# EAGLE schematic carte_mere_mbed (EAGLE 6.1)
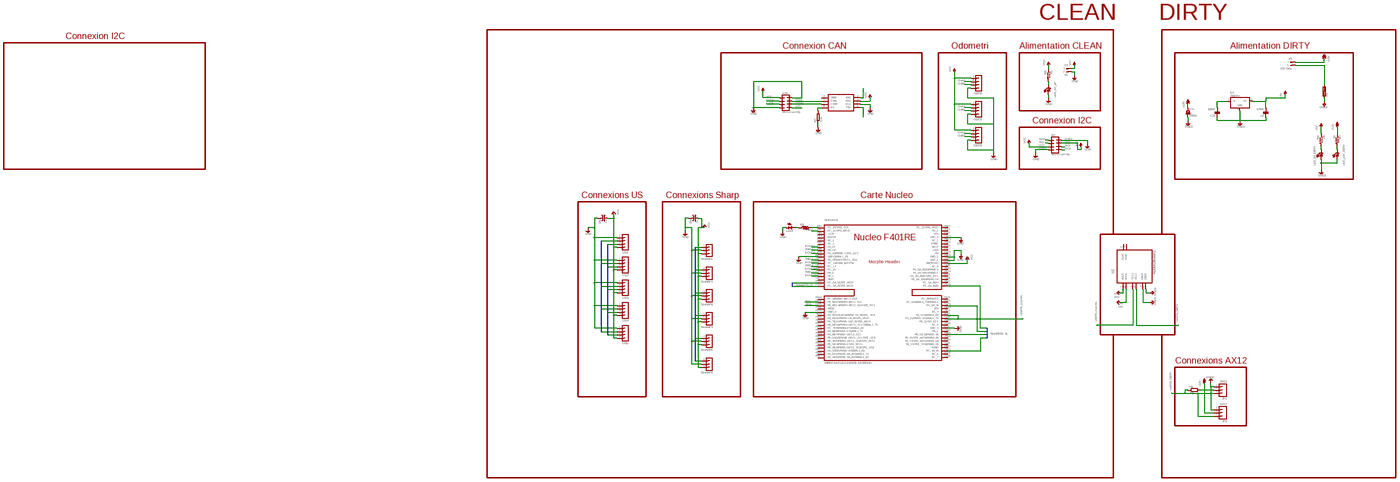
[diagram p0: schematic, sheet 1, overview]
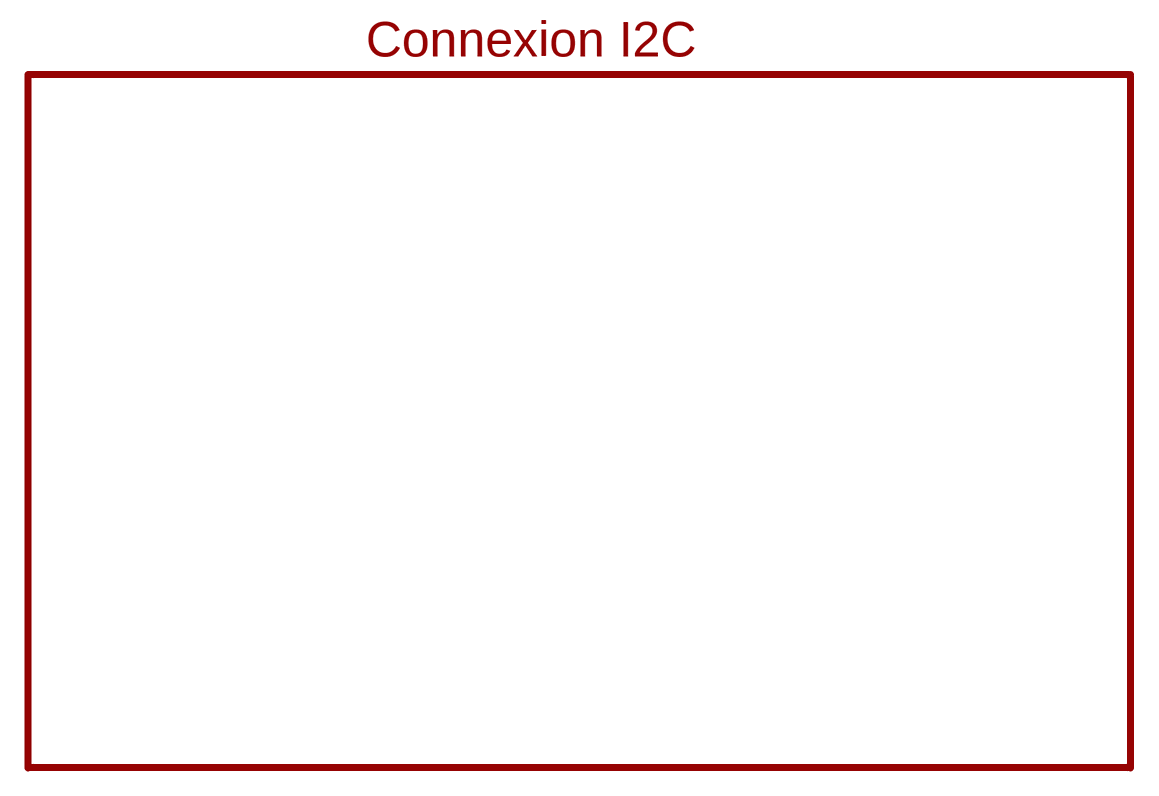
[diagram p1: schematic, sheet 1, part 1 of 4]
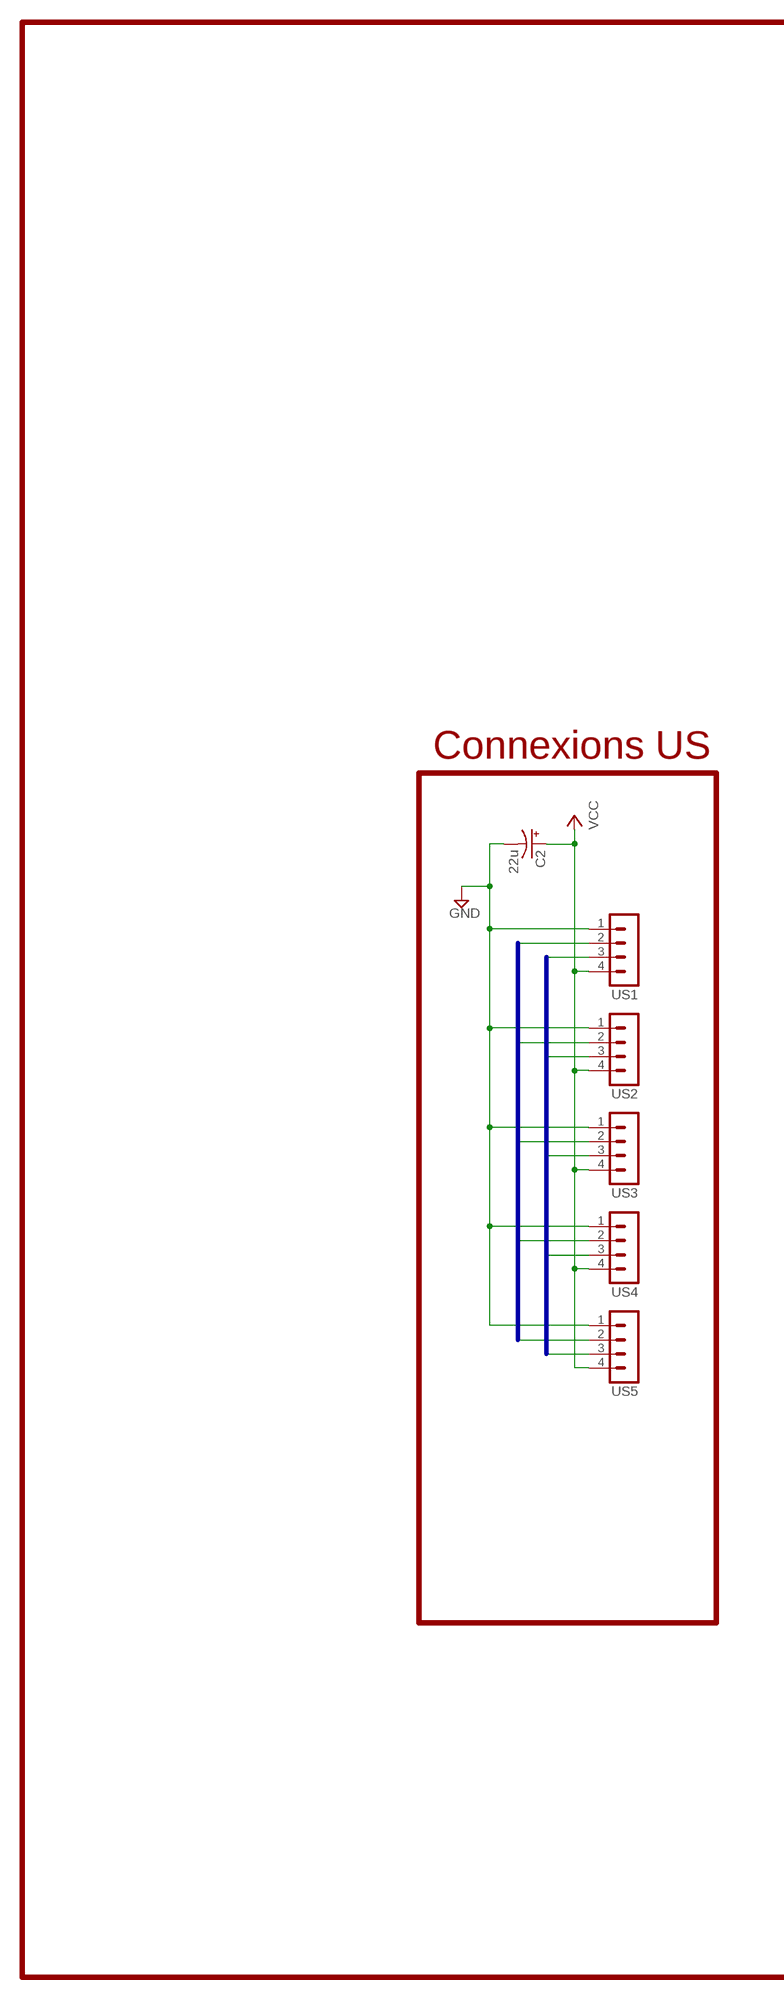
[diagram p2: schematic, sheet 1, part 2 of 4]
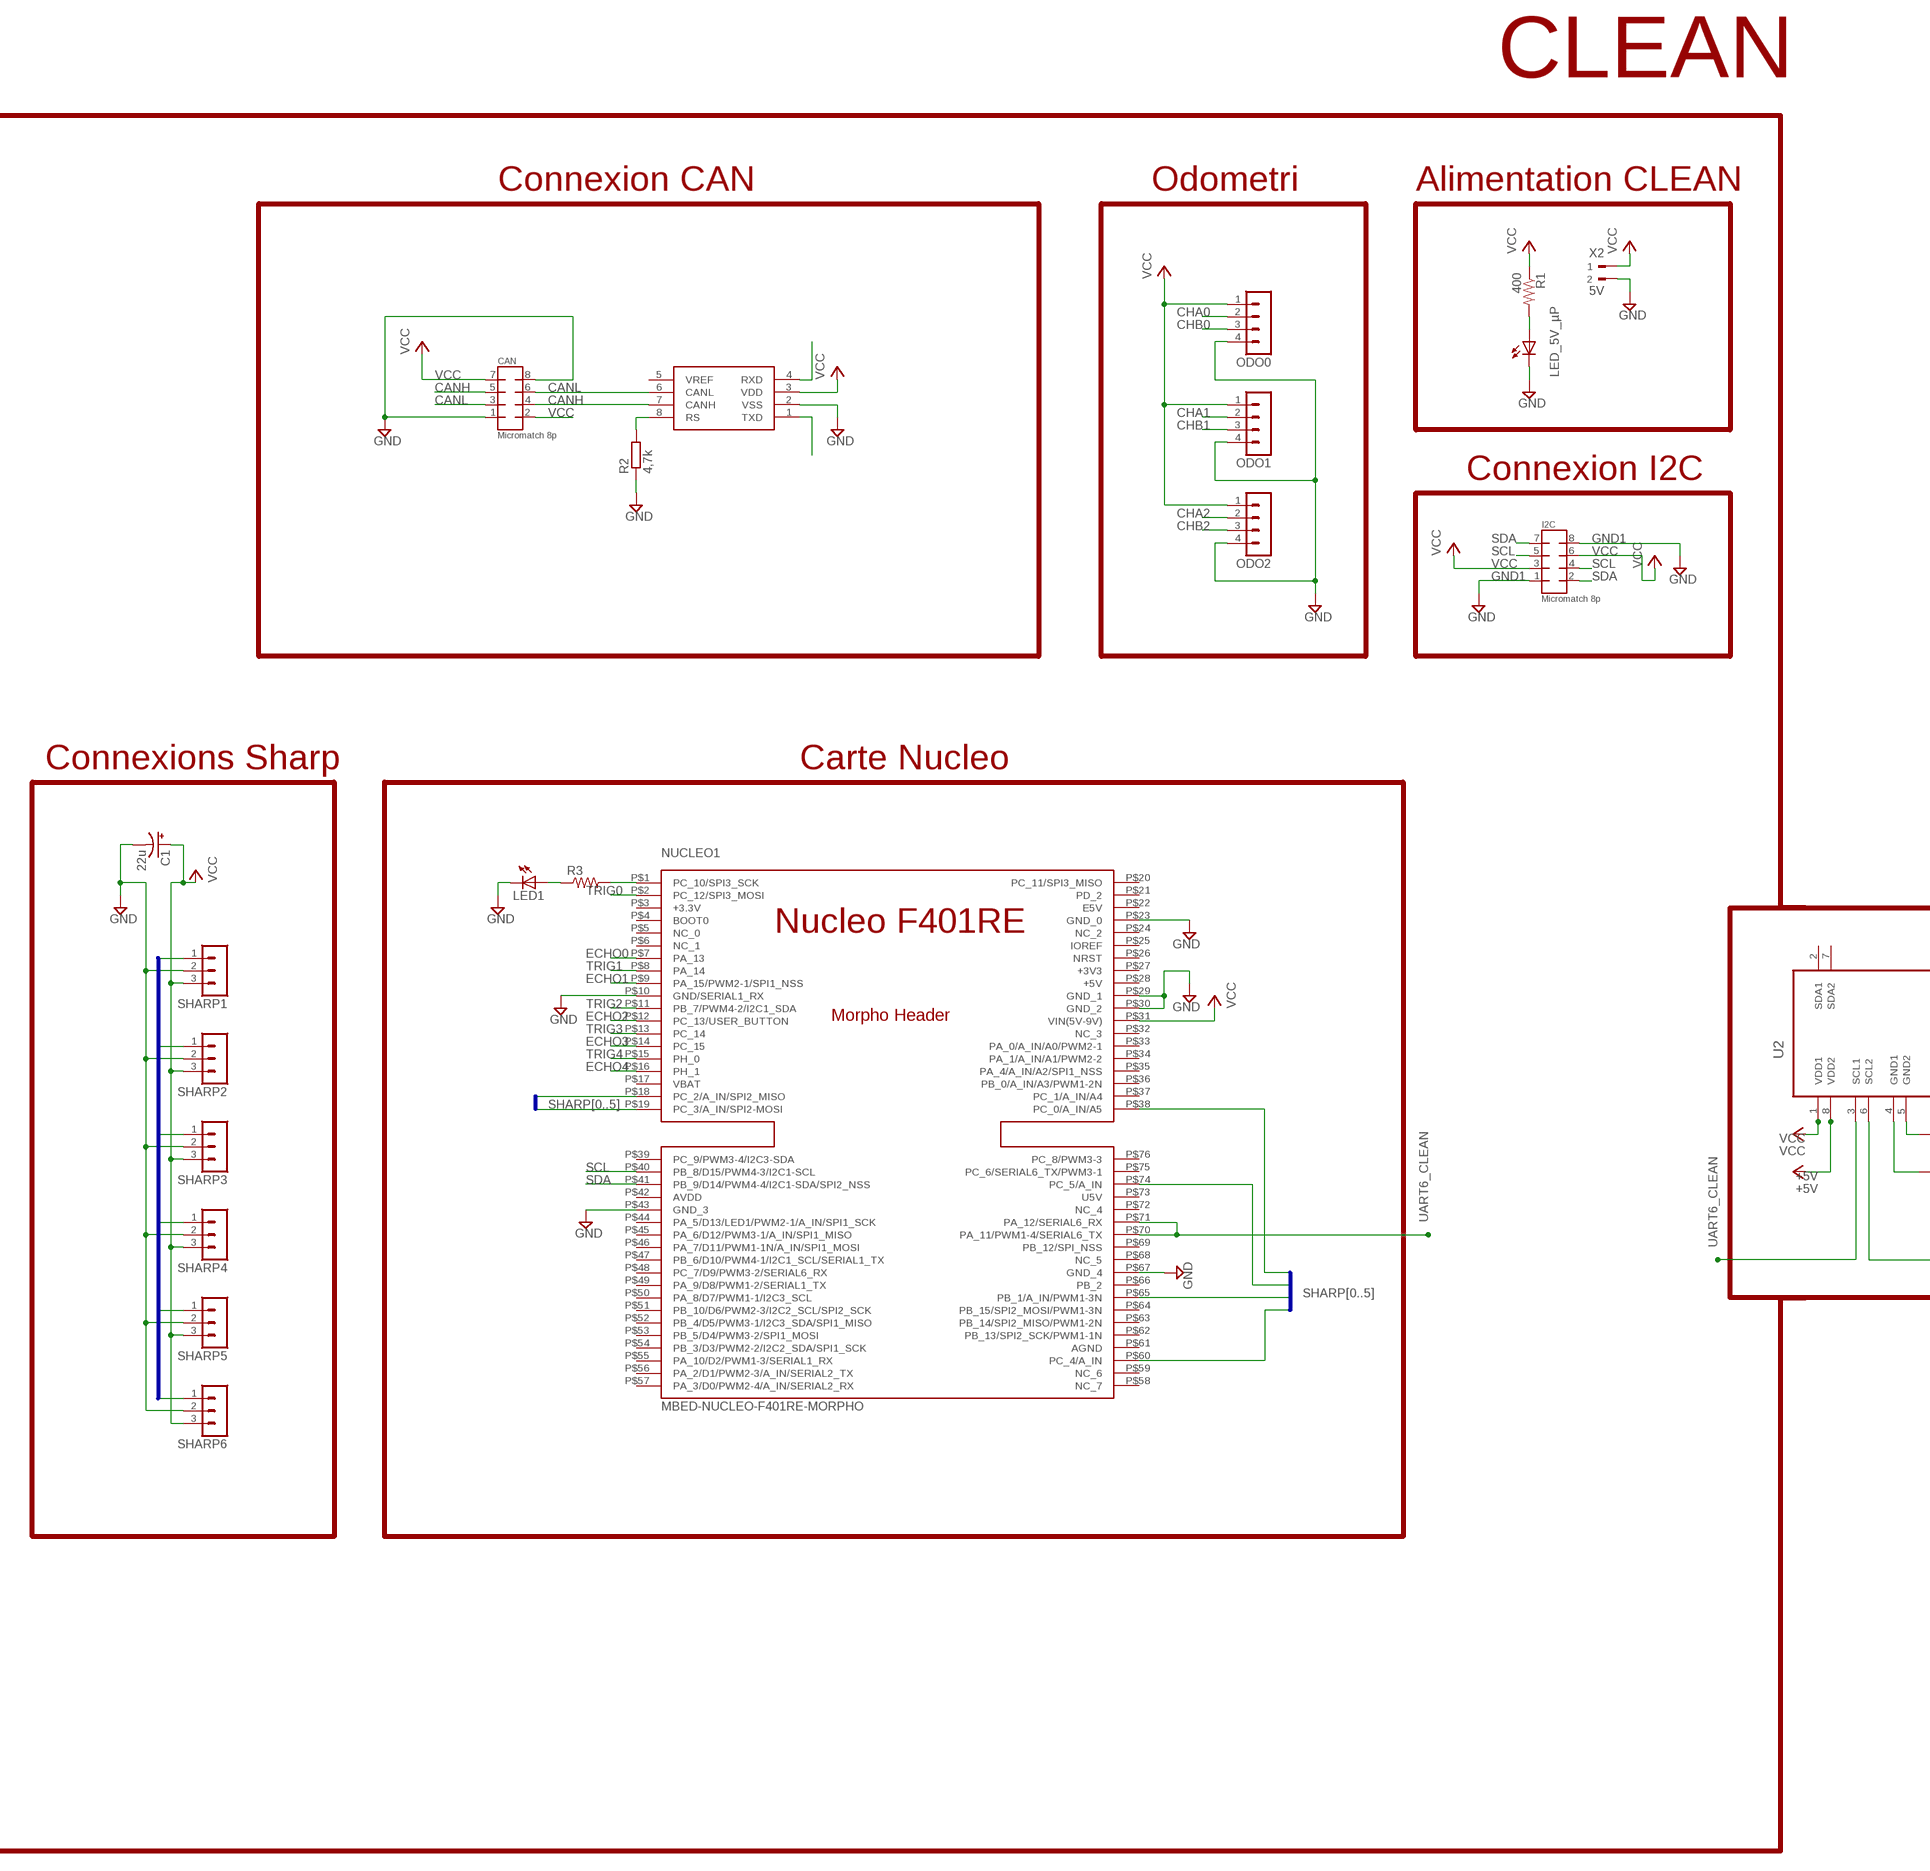
[diagram p3: schematic, sheet 1, part 3 of 4]
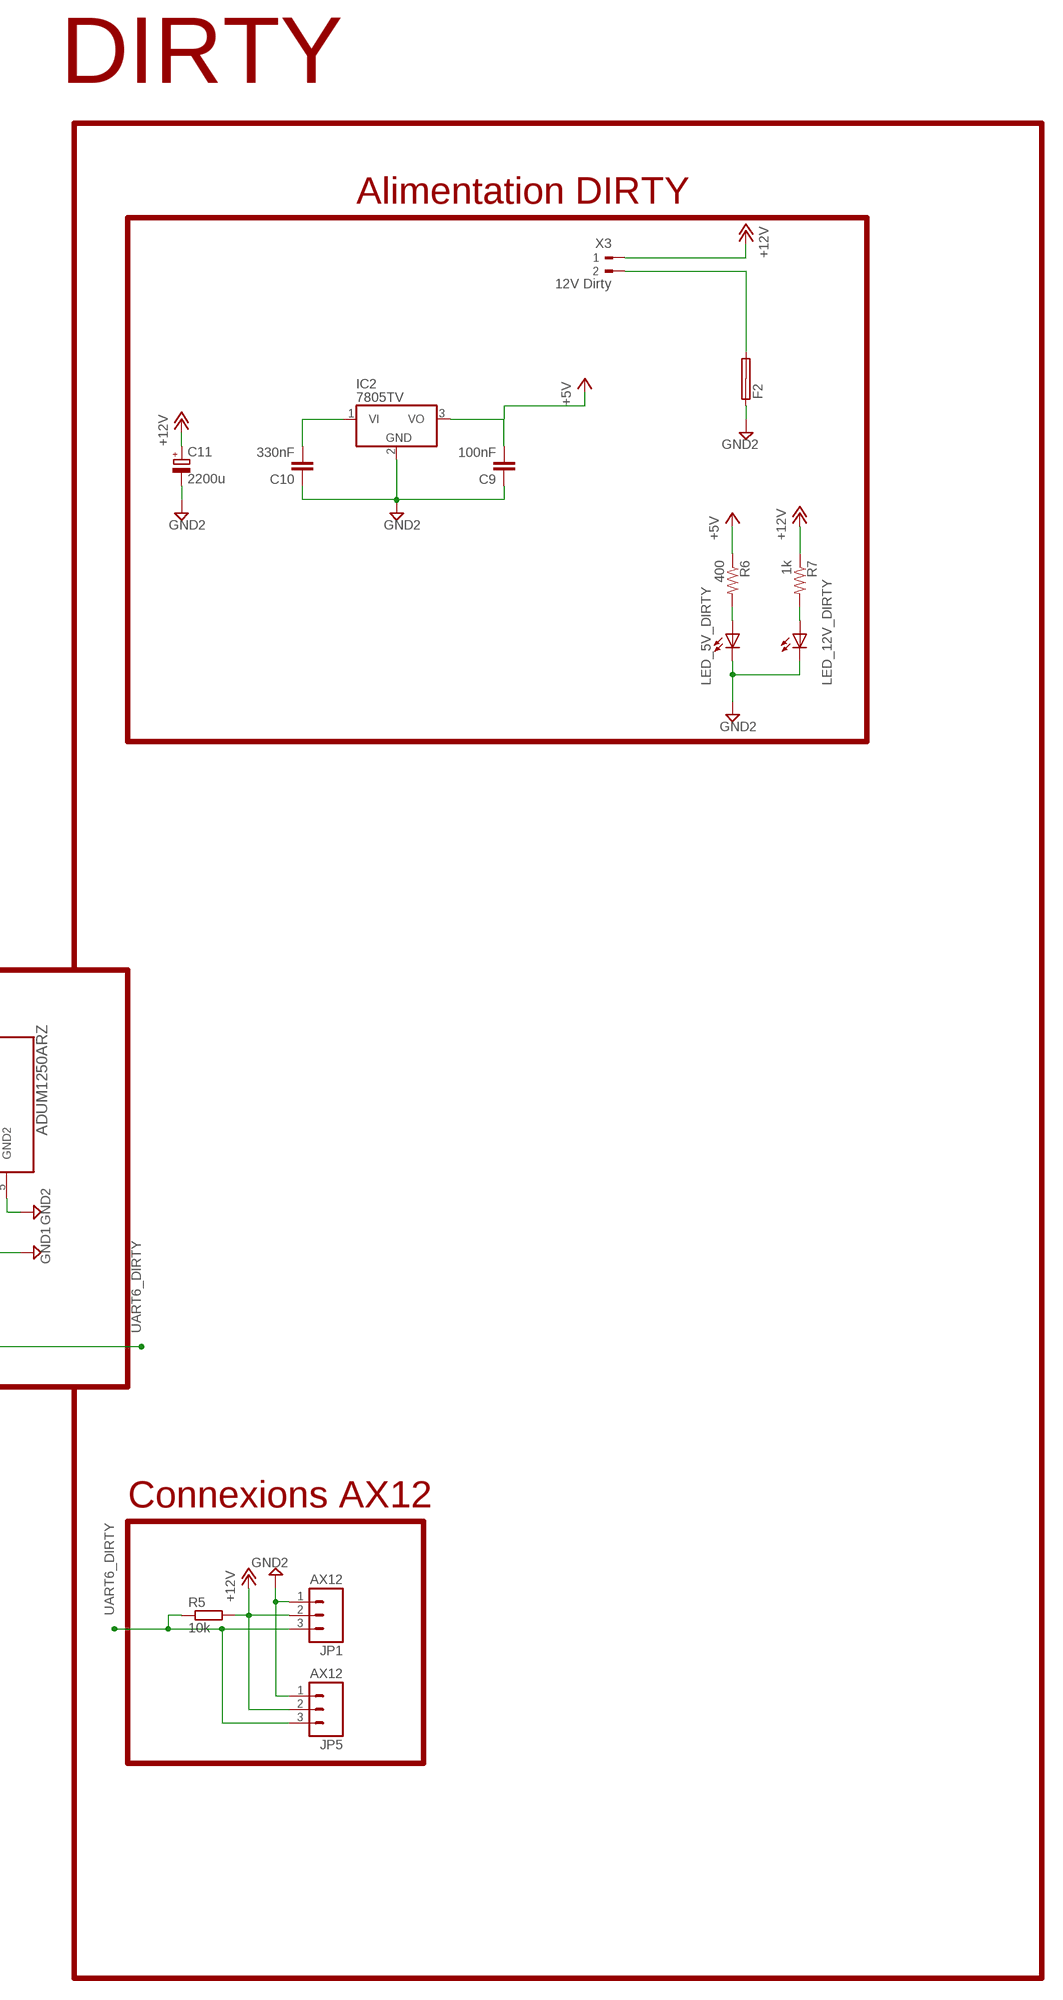
[diagram p4: schematic, sheet 1, part 4 of 4]

## Parts
C1  22u  CAP_POLPTH1  [CPOL-RADIAL-100UF-25V]
C2  22u  CAP_POLPTH1  [CPOL-RADIAL-100UF-25V]
C9  100nF  C-EUC0805  [C0805]
C10  330nF  C-EUC0805  [C0805]
C11  2200u  CPOL-EUTT5D11  [TT5D11]
CAN  Micromatch 8p  MMATCH-8-PTH  [AMP-215079-8]
F2  SHK20Q  [SHK20Q]
I2C  Micromatch 8p  MMATCH-8-PTH  [AMP-215079-8]
IC2  7805TV  [TO220V]
JP1  AX12  M03POLAR  [MOLEX-1X3]
JP5  AX12  M03POLAR  [MOLEX-1X3]
LED1  LEDCHIPLED_0805  [CHIPLED_0805]
LED_5V_DIRTY  LEDCHIPLED_0805  [CHIPLED_0805]
LED_5V_µP  LEDCHIPLED_0805  [CHIPLED_0805]
LED_12V_DIRTY  LEDCHIPLED_0805  [CHIPLED_0805]
NUCLEO1  MBED-NUCLEO-F401RE-MORPHO  MBED-NUCLEO-F401RE-MORPHONUCLEOF401RE-MORPHO  [MORPHO-HEADERS]
ODO0  MA04-1  [MA04-1]
ODO1  MA04-1  [MA04-1]
ODO2  MA04-1  [MA04-1]
R1  400  RESISTOR0805-RES  [0805]
R2  4,7k  R-EU_M0805  [M0805]
R3  RESISTOR0805-RES  [0805]
R5  10k  R-EU_M0805  [M0805]
R6  400  RESISTOR0805-RES  [0805]
R7  1k  RESISTOR0805-RES  [0805]
SHARP1  MA03-1  [MA03-1]
SHARP2  MA03-1  [MA03-1]
SHARP3  MA03-1  [MA03-1]
SHARP4  MA03-1  [MA03-1]
SHARP5  MA03-1  [MA03-1]
SHARP6  MA03-1  [MA03-1]
U1  MCP2551  [SO08]
U2  ADUM1250ARZ  [SOIC127P600X175-8N]
US1  MA04-1  [MA04-1]
US2  MA04-1  [MA04-1]
US3  MA04-1  [MA04-1]
US4  MA04-1  [MA04-1]
US5  MA04-1  [MA04-1]
X2  5V  90-2  [90-2]
X3  12V Dirty  90-2  [90-2]

## Nets
+5V: C9.2 IC2.3(VO) R6.1 U2.8(VDD2)
+12V: C11.+ JP1.2 JP5.2 R5.2 R7.1 X3.1
CANH: CAN.4 CAN.5 U1.7(CANH)
CANL: CAN.3 CAN.6 U1.6(CANL)
CHA0: ODO0.2
CHA1: ODO1.2
CHA2: ODO2.2
CHB0: ODO0.3
CHB1: ODO1.3
CHB2: ODO2.3
ECHO0: NUCLEO1.P$7(PA_13) US1.3
ECHO1: NUCLEO1.P$9(PA_15/PWM2-1/SPI1_NSS) US2.3
ECHO2: NUCLEO1.P$12(PC_13/USER_BUTTON) US3.3
ECHO3: NUCLEO1.P$14(PC_15) US4.3
ECHO4: NUCLEO1.P$16(PH_1) US5.3
GND1: C1.2(-) C2.2(-) CAN.1 CAN.8 I2C.1 I2C.8 LED1.C LED_5V_µP.C NUCLEO1.P$10(GND/SERIAL1_RX) NUCLEO1.P$23(GND_0) NUCLEO1.P$29(GND_1) NUCLEO1.P$30(GND_2) NUCLEO1.P$43(GND_3) NUCLEO1.P$67(GND_4) ODO0.4 ODO1.4 ODO2.4 R2.1 SHARP1.2 SHARP2.2 SHARP3.2 SHARP4.2 SHARP5.2 SHARP6.2 U1.2(VSS) U2.4(GND1) US1.1 US2.1 US3.1 US4.1 US5.1 X2.2 ; supply symbol labelled GND
GND2: C9.1 C10.1 C11.- F2.1A IC2.2(GND) JP1.1 JP5.1 LED_5V_DIRTY.C LED_12V_DIRTY.C U2.5(GND2)
N$1: NUCLEO1.P$1(PC_10/SPI3_SCK) R3.2
N$2: LED_5V_DIRTY.A R6.2
N$3: U1.4(RXD)
N$4: R2.2 U1.8(RS)
N$5: U1.1(TXD)
N$6: LED1.A R3.1
N$11: LED_12V_DIRTY.A R7.2
N$12: LED_5V_µP.A R1.2
N$27: F2.2A X3.2
N$32: C10.2 IC2.1(VI)
SCL: I2C.4 I2C.5 NUCLEO1.P$40(PB_8/D15/PWM4-3/I2C1-SCL)
SDA: I2C.2 I2C.7 NUCLEO1.P$41(PB_9/D14/PWM4-4/I2C1-SDA/SPI2_NSS)
SHARP0: NUCLEO1.P$74(PC_5/A_IN) SHARP1.1
SHARP1: NUCLEO1.P$65(PB_1/A_IN/PWM1-3N) SHARP2.1
SHARP2: NUCLEO1.P$60(PC_4/A_IN) SHARP3.1
SHARP3: NUCLEO1.P$19(PC_3/A_IN/SPI2-MOSI) SHARP4.1
SHARP4: NUCLEO1.P$18(PC_2/A_IN/SPI2_MISO) SHARP5.1
SHARP5: NUCLEO1.P$38(PC_0/A_IN/A5) SHARP6.1
TRIG0: NUCLEO1.P$2(PC_12/SPI3_MOSI) US1.2
TRIG1: NUCLEO1.P$8(PA_14) US2.2
TRIG2: NUCLEO1.P$11(PB_7/PWM4-2/I2C1_SDA) US3.2
TRIG3: NUCLEO1.P$13(PC_14) US4.2
TRIG4: NUCLEO1.P$15(PH_0) US5.2
UART6_CLEAN: NUCLEO1.P$70(PA_11/PWM1-4/SERIAL6_TX) NUCLEO1.P$71(PA_12/SERIAL6_RX) U2.3(SCL1)
UART6_DIRTY: JP1.3 JP5.3 R5.1 U2.6(SCL2)
VCC: C1.1(+) C2.1(+) CAN.2 CAN.7 I2C.3 I2C.6 NUCLEO1.P$31(VIN(5V-9V)) ODO0.1 ODO1.1 ODO2.1 R1.1 SHARP1.3 SHARP2.3 SHARP3.3 SHARP4.3 SHARP5.3 SHARP6.3 U1.3(VDD) U2.1(VDD1) US1.4 US2.4 US3.4 US4.4 US5.4 X2.1
Unconnected: F2.1B F2.2B NUCLEO1.P$3(+3.3V) NUCLEO1.P$4(BOOT0) NUCLEO1.P$5(NC_0) NUCLEO1.P$6(NC_1) NUCLEO1.P$17(VBAT) NUCLEO1.P$20(PC_11/SPI3_MISO) NUCLEO1.P$21(PD_2) NUCLEO1.P$22(E5V) NUCLEO1.P$24(NC_2) NUCLEO1.P$25(IOREF) NUCLEO1.P$26(NRST) NUCLEO1.P$27(+3V3) NUCLEO1.P$28(+5V) NUCLEO1.P$32(NC_3) NUCLEO1.P$33(PA_0/A_IN/A0/PWM2-1) NUCLEO1.P$34(PA_1/A_IN/A1/PWM2-2) NUCLEO1.P$35(PA_4/A_IN/A2/SPI1_NSS) NUCLEO1.P$36(PB_0/A_IN/A3/PWM1-2N) NUCLEO1.P$37(PC_1/A_IN/A4) NUCLEO1.P$39(PC_9/PWM3-4/I2C3-SDA) NUCLEO1.P$42(AVDD) NUCLEO1.P$44(PA_5/D13/LED1/PWM2-1/A_IN/SPI1_SCK) NUCLEO1.P$45(PA_6/D12/PWM3-1/A_IN/SPI1_MISO) NUCLEO1.P$46(PA_7/D11/PWM1-1N/A_IN/SPI1_MOSI) NUCLEO1.P$47(PB_6/D10/PWM4-1/I2C1_SCL/SERIAL1_TX) NUCLEO1.P$48(PC_7/D9/PWM3-2/SERIAL6_RX) NUCLEO1.P$49(PA_9/D8/PWM1-2/SERIAL1_TX) NUCLEO1.P$50(PA_8/D7/PWM1-1/I2C3_SCL) NUCLEO1.P$51(PB_10/D6/PWM2-3/I2C2_SCL/SPI2_SCK) NUCLEO1.P$52(PB_4/D5/PWM3-1/I2C3_SDA/SPI1_MISO) NUCLEO1.P$53(PB_5/D4/PWM3-2/SPI1_MOSI) NUCLEO1.P$54(PB_3/D3/PWM2-2/I2C2_SDA/SPI1_SCK) NUCLEO1.P$55(PA_10/D2/PWM1-3/SERIAL1_RX) NUCLEO1.P$56(PA_2/D1/PWM2-3/A_IN/SERIAL2_TX) NUCLEO1.P$57(PA_3/D0/PWM2-4/A_IN/SERIAL2_RX) NUCLEO1.P$58(NC_7) NUCLEO1.P$59(NC_6) NUCLEO1.P$61(AGND) NUCLEO1.P$62(PB_13/SPI2_SCK/PWM1-1N) NUCLEO1.P$63(PB_14/SPI2_MISO/PWM1-2N) NUCLEO1.P$64(PB_15/SPI2_MOSI/PWM1-3N) NUCLEO1.P$66(PB_2) NUCLEO1.P$68(NC_5) NUCLEO1.P$69(PB_12/SPI_NSS) NUCLEO1.P$72(NC_4) NUCLEO1.P$73(U5V) NUCLEO1.P$75(PC_6/SERIAL6_TX/PWM3-1) NUCLEO1.P$76(PC_8/PWM3-3) U1.5(VREF) U2.2(SDA1) U2.7(SDA2)

## Buses
SHARP[0..5]
ECHO[0..5]
TRIG[0..5]

## Notes on the sheet
- CLEAN
- DIRTY
- Connexion I2C
- Connexion CAN | Odometri | Alimentation CLEAN | Alimentation DIRTY
- Connexion I2C
- Connexions US | Connexions Sharp | Carte Nucleo
- Connexions AX12

## Library data of the parts
C1 C2 = SparkFun-Capacitors:CAP_POL: Capacitor Polarized These are standard SMD and PTH capacitors. Normally 10uF, 47uF, and 100uF in electrolytic and tantalum varieties. Always verify the external diameter of the through hole cap, it varies with capacity, voltage, and manufacturer. The EIA devices should be standard.
C9 C10 = rcl:C-EU: CAPACITOR, European symbol
C11 = rcl:CPOL-EU: POLARIZED CAPACITOR, European symbol
CAN I2C = jt-con-micromatch:MMATCH-8-*: AMP Micromatch 8-pin
F2 = fuse:SHK20Q: FUSE HOLDER 5 x 20 mm, SH contact, E1207 Buerklin 64G6061; OC_FARNELL: unknown; OC_NEWARK: unknown
IC2 = linear:78*: Positive VOLTAGE REGULATOR Source: http://cache.national.com/ds/LM/LM78L05.pdf http://www.fairchildsemi.com/ds/LM/LM7805.pdf
JP1 JP5 = SparkFun-Connectors:M03: Header 3 Standard 3-pin 0.1" header. Use with straight break away headers (SKU : PRT-00116), right angle break away headers (PRT-00553), swiss pins (PRT-00743), machine pins (PRT-00117), and female headers (PRT-00115). Molex polarized connector foot print use with SKU : PRT-08232 with associated crimp pins and housings.
LED1 LED_5V_DIRTY LED_5V_µP LED_12V_DIRTY = adafruit:LED: LED OSRAM: - CHIPLED LG R971, LG N971, LY N971, LG Q971, LY Q971, LO R971, LY R971 LH N974, LH R974 LS Q976, LO Q976, LY Q976 LO Q996 - Hyper CHIPLED LW Q18S LB Q993, LB Q99A, LB R99A - SideLED LS A670, LO A670, LY A670, LG A670, LP A670 LB A673, LV A673, LT A673, LW A673 LH A674 LY A675 LS A676, LA A676, LO A676, LY A676, LW A676 LS A679, LY A679, LG A679 - Hyper Micro SIDELED® LS Y876, LA Y876, LO Y876, LY Y876 LT Y87S - SmartLED LW L88C, LW L88S LB L89C, LB L89S, LG L890 LS L89K, LO L89K, LY L89K LS L896, LA L896, LO L896, LY L896 - TOPLED LS T670, LO T670, LY T670, LG T670, LP T670 LSG T670, LSP T670, LSY T670, LOP T670, LYG T670 LG T671, LOG T671, LSG T671 LB T673, LV T673, LT T673, LW T673 LH T674 LS T676, LA T676, LO T676, LY T676, LB T676, LH T676, LSB T676, LW T676 LB T67C, LV T67C, LT T67C, LS T67K, LO T67K, LY T67K, LW E67C LS E67B, LA E67B, LO E67B, LY E67B, LB E67C, LV E67C, LT E67C LW T67C LS T679, LY T679, LG T679 LS T770, LO T770, LY T770, LG T770, LP T770 LB T773, LV T773, LT T773, LW T773 LH T774 LS E675, LA E675, LY E675, LS T675 LS T776, LA T776, LO T776, LY T776, LB T776 LHGB T686 LT T68C, LB T68C - Hyper Mini TOPLED® LB M676 - Mini TOPLED Santana® LG M470 LS M47K, LO M47K, LY M47K Source: http://www.osram.convergy.de/
NUCLEO1 = mbed-nucleo:MBED-NUCLEO-F401RE-MORPHO
ODO0 ODO1 ODO2 US1-US5 = con-lstb:MA04-1: PIN HEADER; OC_FARNELL: unknown; OC_NEWARK: unknown
R1 R6 R7 = SparkFun-Passives:RESISTOR: Resistor Basic schematic elements and footprints for 0603, 1206, and PTH resistors.; OC_FARNELL: unknown
R2 R5 = rcl:R-EU_: RESISTOR, European symbol
R3 = SparkFun-Resistors:RESISTOR: Resistor Basic schematic elements and footprints for 0603, 1206, and PTH resistors.
SHARP1-SHARP6 = con-lstb:MA03-1: PIN HEADER; OC_FARNELL: unknown; OC_NEWARK: unknown
U1 = SparkFun-DigitalIC:MCP2551: CAN transceiver
U2 = Analog Devices_By_element14_Batch_1:ADUM1250ARZ: Hot Swappable, Dual I2C Isolators; MPN: ADUM1250ARZ; OC_FARNELL: 1814353; OC_NEWARK: 27M9880; PACKAGE: SOIC-8; SUPPLIER: Analog Devices
X2 X3 = con-weidmueller-sl35:90-2: WEIDMUELLER CLAMP CONNECTOR; OC_FARNELL: unknown; OC_NEWARK: unknown

## Net classes
1 +5V: width 0.6 mm, drill 0.2 mm, clearance 0.4 mm